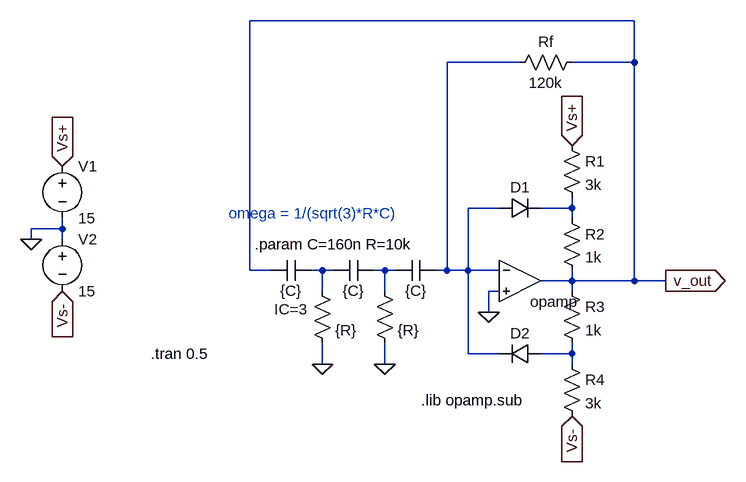
[diagram p0: schematic phase_shift_oscillator.asc]
phase_shift_oscillator.asc, the LTspice schematic file:
Version 4
SHEET 1 880 680
WIRE 384 -224 -208 -224
WIRE 208 -160 96 -160
WIRE 384 -160 384 -224
WIRE 384 -160 288 -160
WIRE 176 64 128 64
WIRE 288 64 288 48
WIRE 288 64 240 64
WIRE 288 80 288 64
WIRE -496 96 -496 80
WIRE -496 96 -544 96
WIRE -544 112 -544 96
WIRE -496 112 -496 96
WIRE -208 160 -208 -224
WIRE -176 160 -208 160
WIRE -96 160 -112 160
WIRE -80 160 -96 160
WIRE 0 160 -16 160
WIRE 16 160 0 160
WIRE 96 160 96 -160
WIRE 96 160 80 160
WIRE 128 160 128 64
WIRE 128 160 96 160
WIRE 176 160 128 160
WIRE 288 176 288 160
WIRE 288 176 240 176
WIRE 384 176 384 -160
WIRE 384 176 288 176
WIRE 432 176 384 176
WIRE -96 192 -96 160
WIRE 0 192 0 160
WIRE 176 192 160 192
WIRE 288 192 288 176
WIRE 160 224 160 192
WIRE 128 288 128 160
WIRE 176 288 128 288
WIRE 288 288 288 272
WIRE 288 288 240 288
WIRE -96 304 -96 272
WIRE 0 304 0 272
WIRE 288 304 288 288
FLAG 160 224 0
FLAG 288 384 Vs-
IOPIN 288 384 In
FLAG 288 -32 Vs+
IOPIN 288 -32 In
FLAG 0 304 0
FLAG 432 176 v_out
IOPIN 432 176 Out
FLAG -544 112 0
FLAG -496 192 Vs-
IOPIN -496 192 In
FLAG -496 0 Vs+
IOPIN -496 0 In
FLAG -96 304 0
SYMBOL OpAmps\\opamp 208 112 R0
WINDOW 0 0 32 Invisible 2
SYMATTR InstName U1
SYMBOL res 272 64 R0
SYMATTR InstName R2
SYMATTR Value 1k
SYMBOL res 272 -48 R0
SYMATTR InstName R1
SYMATTR Value 3k
SYMBOL res 272 176 R0
SYMATTR InstName R3
SYMATTR Value 1k
SYMBOL res 272 288 R0
SYMATTR InstName R4
SYMATTR Value 3k
SYMBOL diode 176 80 R270
WINDOW 0 32 32 VTop 2
WINDOW 3 0 32 Invisible 2
SYMATTR InstName D1
SYMBOL diode 240 272 R90
WINDOW 0 0 32 VBottom 2
WINDOW 3 32 32 Invisible 2
SYMATTR InstName D2
SYMBOL cap 80 144 R90
WINDOW 0 0 32 Invisible 2
WINDOW 3 32 32 VTop 2
SYMATTR InstName C_c
SYMATTR Value {C}
SYMBOL cap -16 144 R90
WINDOW 0 0 32 Invisible 2
WINDOW 3 32 32 VTop 2
SYMATTR InstName C_b
SYMATTR Value {C}
SYMBOL cap -112 144 R90
WINDOW 0 0 32 Invisible 2
WINDOW 3 32 32 VTop 2
WINDOW 39 60 32 VTop 2
SYMATTR InstName C_a
SYMATTR Value {C}
SYMATTR SpiceLine IC=3
SYMBOL res -112 176 R0
WINDOW 0 35 101 Invisible 2
SYMATTR InstName R_a
SYMATTR Value {R}
SYMBOL res -16 176 R0
WINDOW 0 34 102 Invisible 2
SYMATTR InstName R_b
SYMATTR Value {R}
SYMBOL res 304 -176 R90
WINDOW 0 0 56 VBottom 2
WINDOW 3 32 56 VTop 2
SYMATTR InstName Rf
SYMATTR Value 120k
SYMBOL voltage -496 -16 R0
SYMATTR InstName V1
SYMATTR Value 15
SYMBOL voltage -496 96 R0
SYMATTR InstName V2
SYMATTR Value 15
TEXT -360 288 Left 2 !.tran 0.5
TEXT 56 360 Left 2 !.lib opamp.sub
TEXT -240 72 Left 2 ;omega = 1/(sqrt(3)*R*C)
TEXT -200 120 Left 2 !.param C=160n R=10k

The netlist it stands for:
* phase_shift_oscillator.asc
XU1 N001 0 v_out opamp Aol=100K GBW=10Meg  ; pins invin noninvin out
R2 N002 v_out 1k
R1 Vs+ N002 3k
R3 v_out N005 1k
R4 N005 Vs- 3k
D1 N001 N002 D
D2 N005 N001 D
C_c N001 N004 {C}
C_b N004 N003 {C}
C_a N003 v_out {C} IC=3
R_a N003 0 {R}
R_b N004 0 {R}
Rf v_out N001 120k
V1 Vs+ 0 15
V2 0 Vs- 15
.model D D
.lib standard.dio
.tran 0.5
.lib opamp.sub
* omega = 1/(sqrt(3)*R*C)
.param C=160n R=10k
.backanno
.end